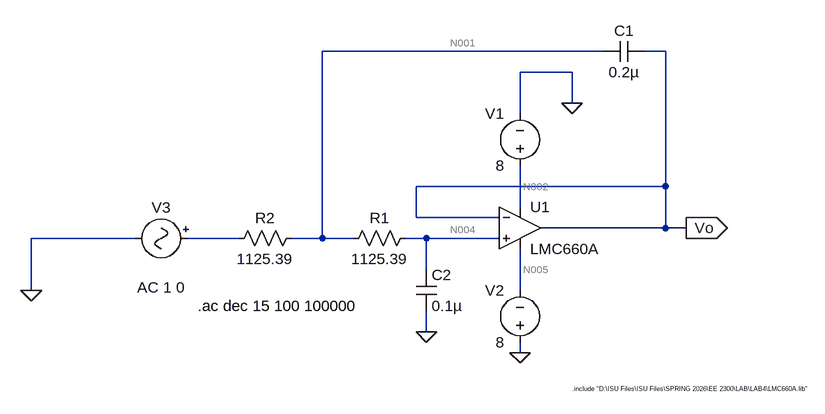
[diagram p0: schematic Exp3_Spice.asc]
Exp3_Spice.asc, the LTspice schematic file:
Version 4.1
SHEET 1 880 680
WIRE 352 -96 -80 -96
WIRE 448 -96 416 -96
WIRE 304 -64 224 -64
WIRE 304 -16 304 -64
WIRE 224 0 224 -64
WIRE 448 112 448 -96
WIRE 448 112 64 112
WIRE 224 144 224 80
WIRE 64 160 64 112
WIRE 192 160 64 160
WIRE 448 176 448 112
WIRE 448 176 256 176
WIRE 480 176 448 176
WIRE -368 192 -528 192
WIRE -208 192 -288 192
WIRE -80 192 -80 -96
WIRE -80 192 -128 192
WIRE -32 192 -80 192
WIRE 80 192 48 192
WIRE 192 192 80 192
WIRE 80 240 80 192
WIRE -528 272 -528 192
WIRE 224 272 224 208
WIRE 80 336 80 304
WIRE 224 368 224 352
FLAG 304 -16 0
FLAG 224 368 0
FLAG 80 336 0
FLAG 480 176 Vo
IOPIN 480 176 Out
FLAG -528 272 0
SYMBOL OpAmps\\opamp2 224 112 R0
SYMATTR InstName U1
SYMATTR Value LMC660A
SYMBOL voltage 224 96 R180
WINDOW 0 24 96 Left 2
WINDOW 3 24 16 Left 2
WINDOW 123 0 0 Left 0
WINDOW 39 0 0 Left 0
SYMATTR InstName V1
SYMATTR Value 8
SYMBOL voltage 224 368 R180
WINDOW 0 24 96 Left 2
WINDOW 3 24 16 Left 2
WINDOW 123 0 0 Left 0
WINDOW 39 0 0 Left 0
SYMATTR InstName V2
SYMATTR Value 8
SYMBOL res 64 176 R90
WINDOW 0 0 56 VBottom 2
WINDOW 3 32 56 VTop 2
SYMATTR InstName R1
SYMATTR Value 1125.39
SYMBOL res -112 176 R90
WINDOW 0 0 56 VBottom 2
WINDOW 3 32 56 VTop 2
SYMATTR InstName R2
SYMATTR Value 1125.39
SYMBOL cap 416 -112 R90
WINDOW 0 0 32 VBottom 2
WINDOW 3 32 32 VTop 2
SYMATTR InstName C1
SYMATTR Value 0.2µ
SYMBOL cap 64 240 R0
SYMATTR InstName C2
SYMATTR Value 0.1µ
SYMBOL Misc\\signal -272 192 R90
WINDOW 0 -32 56 VBottom 2
WINDOW 3 32 56 VTop 2
WINDOW 123 60 56 VTop 2
WINDOW 39 0 0 Left 0
SYMATTR InstName V3
SYMATTR Value ""
SYMATTR Value2 AC 1 0
TEXT 304 424 Left 0 !.include "D:\\ISU Files\\ISU Files\\SPRING 2026\\EE 2300\\LAB\\LAB4\\LMC660A.lib"
TEXT -272 296 Left 2 !.ac dec 15 100 100000

The netlist it stands for:
* Exp3_Spice.asc
X§U1 N004 Vo N002 N005 Vo LMC660A  ; pins In+ In- V+ V- OUT
V1 N002 0 8
V2 0 N005 8
R1 N004 N001 1125.39
R2 N001 N003 1125.39
C1 Vo N001 0.2µ
C2 N004 0 0.1µ
V3 N003 0 AC 1 0
.include "D:\ISU Files\ISU Files\SPRING 2026\EE 2300\LAB\LAB4\LMC660A.lib"
.ac dec 15 100 100000
.backanno
.end

* Results of the author's LTspice run, read from the files saved beside the schematic
* Operating Point, zero values left out:
*   V(n002) = 8 V
*   V(n005) = -8 V
*   V(vo) = 3 mV
*   I(V1) = -416.3 µA
*   I(V2) = -416.3 µA
*   Ix(u1:50) = -416.3 µA
*   Ix(u1:99) = 416.3 µA
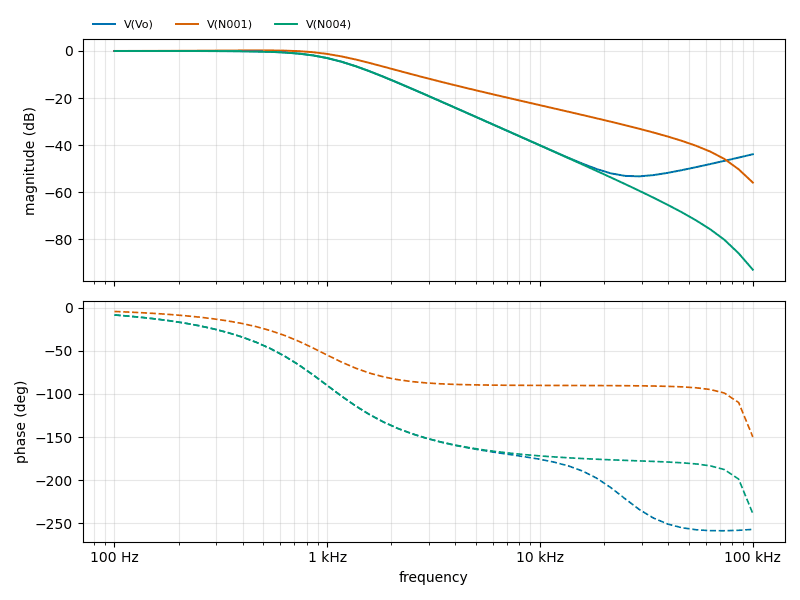
[diagram p1: AC Analysis of Exp3_Spice.asc, plotted from the saved traces]
* AC Analysis, 1 run:
*   V(Vo): 0.00 dB at 100 Hz, -43.83 dB at 100 kHz, peak 0.00 dB at 100 Hz, 3 dB below the peak at 1 kHz
*   V(N001): 0.02 dB at 100 Hz, -55.83 dB at 100 kHz, peak 0.25 dB at 464.2 Hz, 3 dB below the peak at 1.231 kHz
*   V(N004): -0.00 dB at 100 Hz, -92.82 dB at 100 kHz, peak -0.00 dB at 100 Hz, 3 dB below the peak at 1 kHz